# Altium schematic sheet Schematic_pH_CAN.SchDoc: 1
size 420 x 297 mm; Address1: 1; Address2: 1; Address3: 1; Address4: 1; DocumentNumber: 1; Revision: 1; SheetNumber: 1; SheetTotal: 1; Scale: 1:1; Разраб.: Бабанов А.В.; Обозначение документа: АБВГ.123456.001 Э3; Пров.: Кононов М.А.; Утв.: Кононов М.А.; Масштаб: 1:1; Наименование организации: ОАО "Ваша фирма"; Перв. применение: АБВГ.123456.000; Наименование изделия 1: Плата; Наименование изделия 2: Схема электрическая; Наименование изделия 3: принципиальная; Нач. отд.: Нач. отд.; ImagePath: 11; Application_BuildNumber: 1
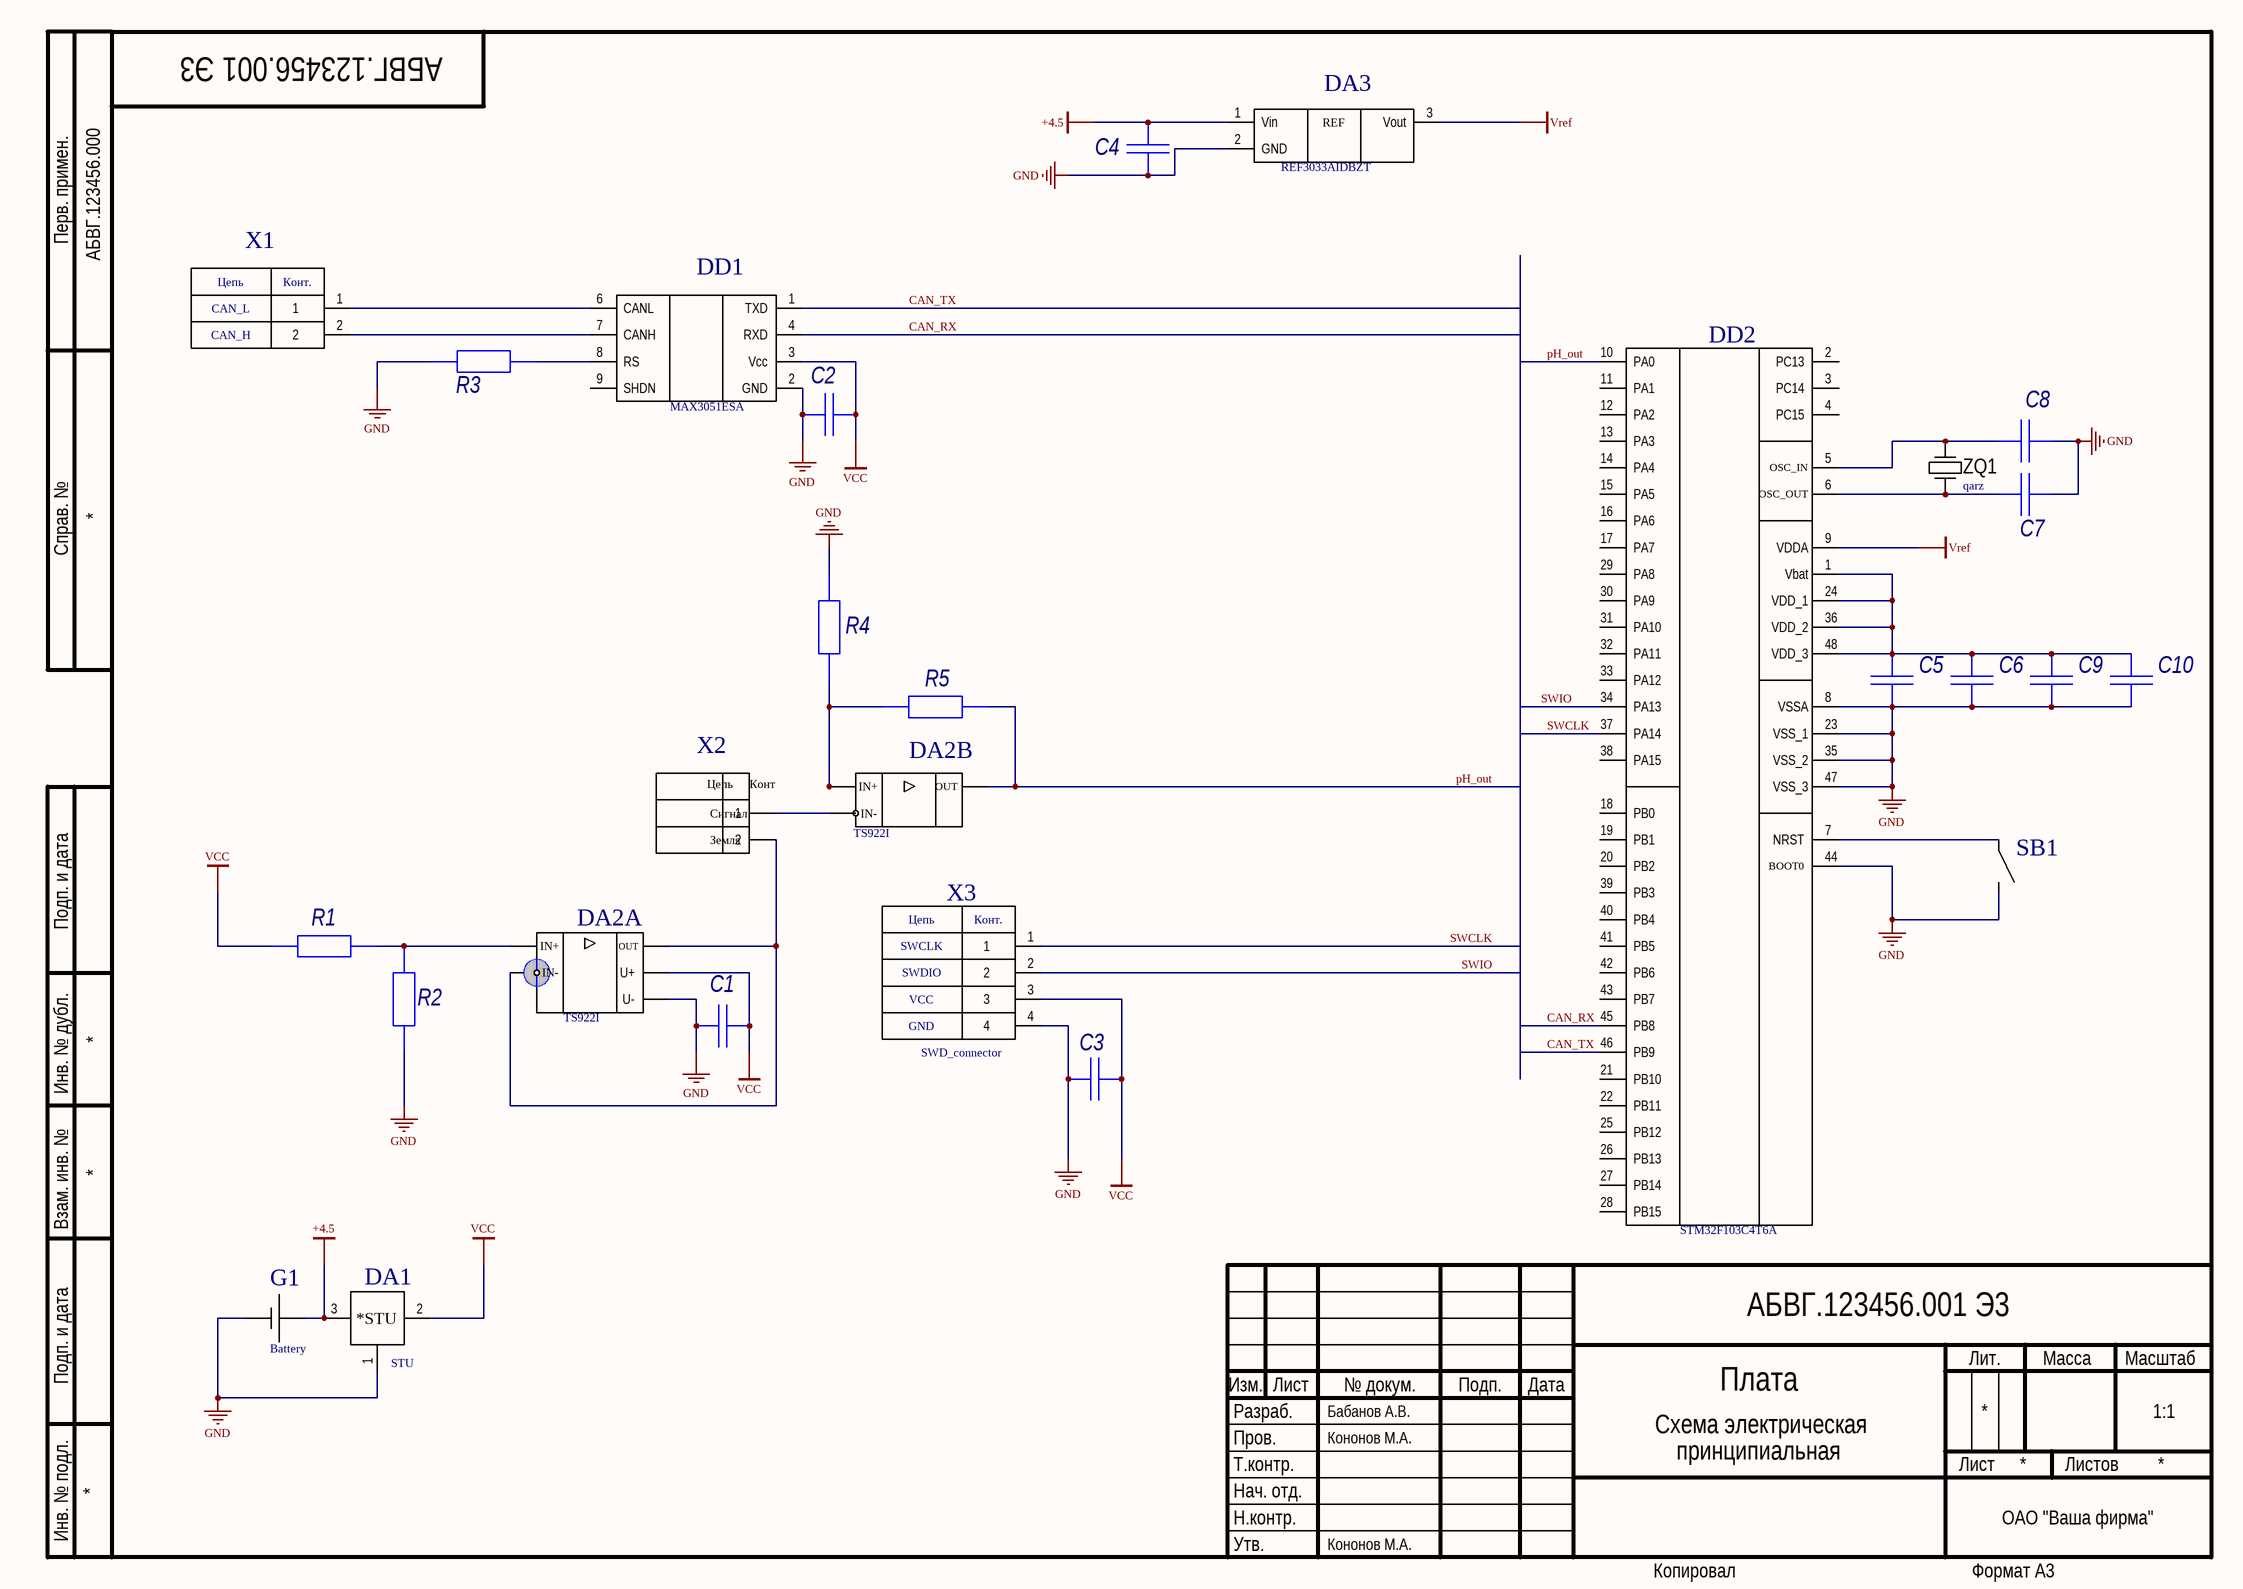
[diagram p0: Schematic_pH_CAN.SchDoc]

## Parts
C1  Capacitor  [CAP: 0805]  (value not drawn)
C2  Capacitor  [CAP: 0805]  (value not drawn)
C3  Capacitor  [CAP: 0805]  (value not drawn)
C4  Capacitor  [CAP: 0805]  (value not drawn)
C5  Capacitor  [CAP: 0805]  (value not drawn)
C6  Capacitor  [CAP: 0805]  (value not drawn)
C7  Capacitor  [CAP: 0805]  (value not drawn)
C8  Capacitor  [CAP: 0805]  (value not drawn)
C9  Capacitor  [CAP: 0805]  (value not drawn)
C10  Capacitor  [CAP: 0805]  (value not drawn)
DA1  STU  [SOT223]
DA2  TS922I  [8-SO]  (parts A,B of 2)
DA3  REF3033AIDBZT
DD1  MAX3051ESA
DD2  STM32F103C4T6A
G1  Battery  [VCC Pad]
R1  Resistor  [RES: 0805]  (value not drawn)
R2  Resistor  [RES: 0805]  (value not drawn)
R3  Resistor  [RES: 0805]  (value not drawn)
R4  Resistor  [RES: 0805]  (value not drawn)
R5  Resistor  [RES: 0805]  (value not drawn)
SB1  KLS7-TS6601-7  [KLS7-TS6601-7]  (value not drawn)
X1  CAN_L/CAN_H  [Клеммная колодка]  (value not drawn)
X2  BNC  [BNC]  (value not drawn)
X3  SWD_connector  [PLS-4]
ZQ1  qarz  [qarz]

## Nets
+4.5: C4.2 DA1.3 DA3.1(Vin) G1.1
GND: C1.2 C2.2 C3.2 C4.1 C5.1 C6.1 C7.2 C8.2 C9.1 C10.1 DA1.1 DA2.4(U-) DA3.2(GND) DD1.2(GND) DD2.8(VSSA) DD2.23(VSS_1) DD2.35(VSS_2) DD2.44(BOOT0) DD2.47(VSS_3) G1.2 R2.1 R3.1 R4.2 SB1.2 X3.4
VCC: C1.1 C2.1 C3.1 DA1.2 DA2.8(U+) DD1.3(Vcc) R1.1 X3.3
Vref: DA3.3(Vout) DD2.9(VDDA)
CAN_RX: DA2.7(OUT) DD1.4(RXD) DD2.10(PA0) DD2.45(PB8) R5.1  [also labelled pH_out]
CAN_TX: DD1.1(TXD) DD2.46(PB9)
SWCLK: DD2.37(PA14) X3.1
SWIO: DD2.34(PA13) X3.2
NetC5_2: C5.2 C6.2 C9.2 C10.2 DD2.1(Vbat) DD2.24(VDD_1) DD2.36(VDD_2) DD2.48(VDD_3)
NetC7_1: C7.1 DD2.6(OSC_OUT) ZQ1.1
NetC8_1: C8.1 DD2.5(OSC_IN) ZQ1.2
NetDA2_1: DA2.1(OUT) DA2.2(IN-) X2.2
NetDA2_3: DA2.3(IN+) R1.2 R2.2
NetDA2_5: DA2.5(IN+) R4.1 R5.2
NetDA2_6: DA2.6(IN-) X2.1
NetDD1_6: DD1.6(CANL) X1.1
NetDD1_7: DD1.7(CANH) X1.2
NetDD1_8: DD1.8(RS) R3.2
NetDD2_7: DD2.7(NRST) SB1.1

Not connected (* = marked no-connect by the designer): DD1 9(SHDN); DD2 2(PC13) 3(PC14) 4(PC15) 11(PA1) 12(PA2) 13(PA3) 14(PA4) 15(PA5) 16(PA6) 17(PA7) 18(PB0) 19(PB1) 20(PB2) 21(PB10) 22(PB11) 25(PB12) 26(PB13) 27(PB14) 28(PB15) 29(PA8) 30(PA9) 31(PA10) 32(PA11) 33(PA12) 38(PA15) 39(PB3) 40(PB4) 41(PB5) 42(PB6) 43(PB7)

## Notes on the sheet
- Перв. примен.
- Справ. №
- Подп. и дата
- Инв. № дубл.
- Взам. инв. №
- Разраб.
- Изм.
- Лист
- № докум.
- Подп.
- Дата
- Лит.
- Масса
- Масштаб
- Пров.
- Т.контр.
- Листов
- Инв. № подл.
- Утв.
- Н.контр.
- Копировал
- Формат А3
- (in symbol BNC) Цепь; Конт; Сигнал; Земля
- (in symbol CAN_L/CAN_H) Цепь; Конт.; CAN_L; CAN_H
- (in symbol REF3033AIDBZT) REF
- (in symbol STU) *STU
- (in symbol SWD_connector) Цепь; Конт.; SWCLK; SWDIO; VCC; GND

## Library data of the parts
C1-C10 = Capacitor: Type: Конденсатор; Published: 18.05.2010; Publisher: Andrew Danich
DA1 = STU: Стабилизатор напряжения
DA2 = TS922I: OPAMP 2 channel
DA3 = REF3033AIDBZT: ИОН 3.3 В
DD2 = STM32F103C4T6A: МК
SB1 = KLS7-TS6601-7: pin to pad: 1>1+2 2>3+4
R1-R5 = Resistor: Published: 24.03.2010; Publisher: Andrew Danich; Type: Резистор